# EAGLE schematic LED-Controller (EAGLE 5.11)

## Sheet 1 of 3
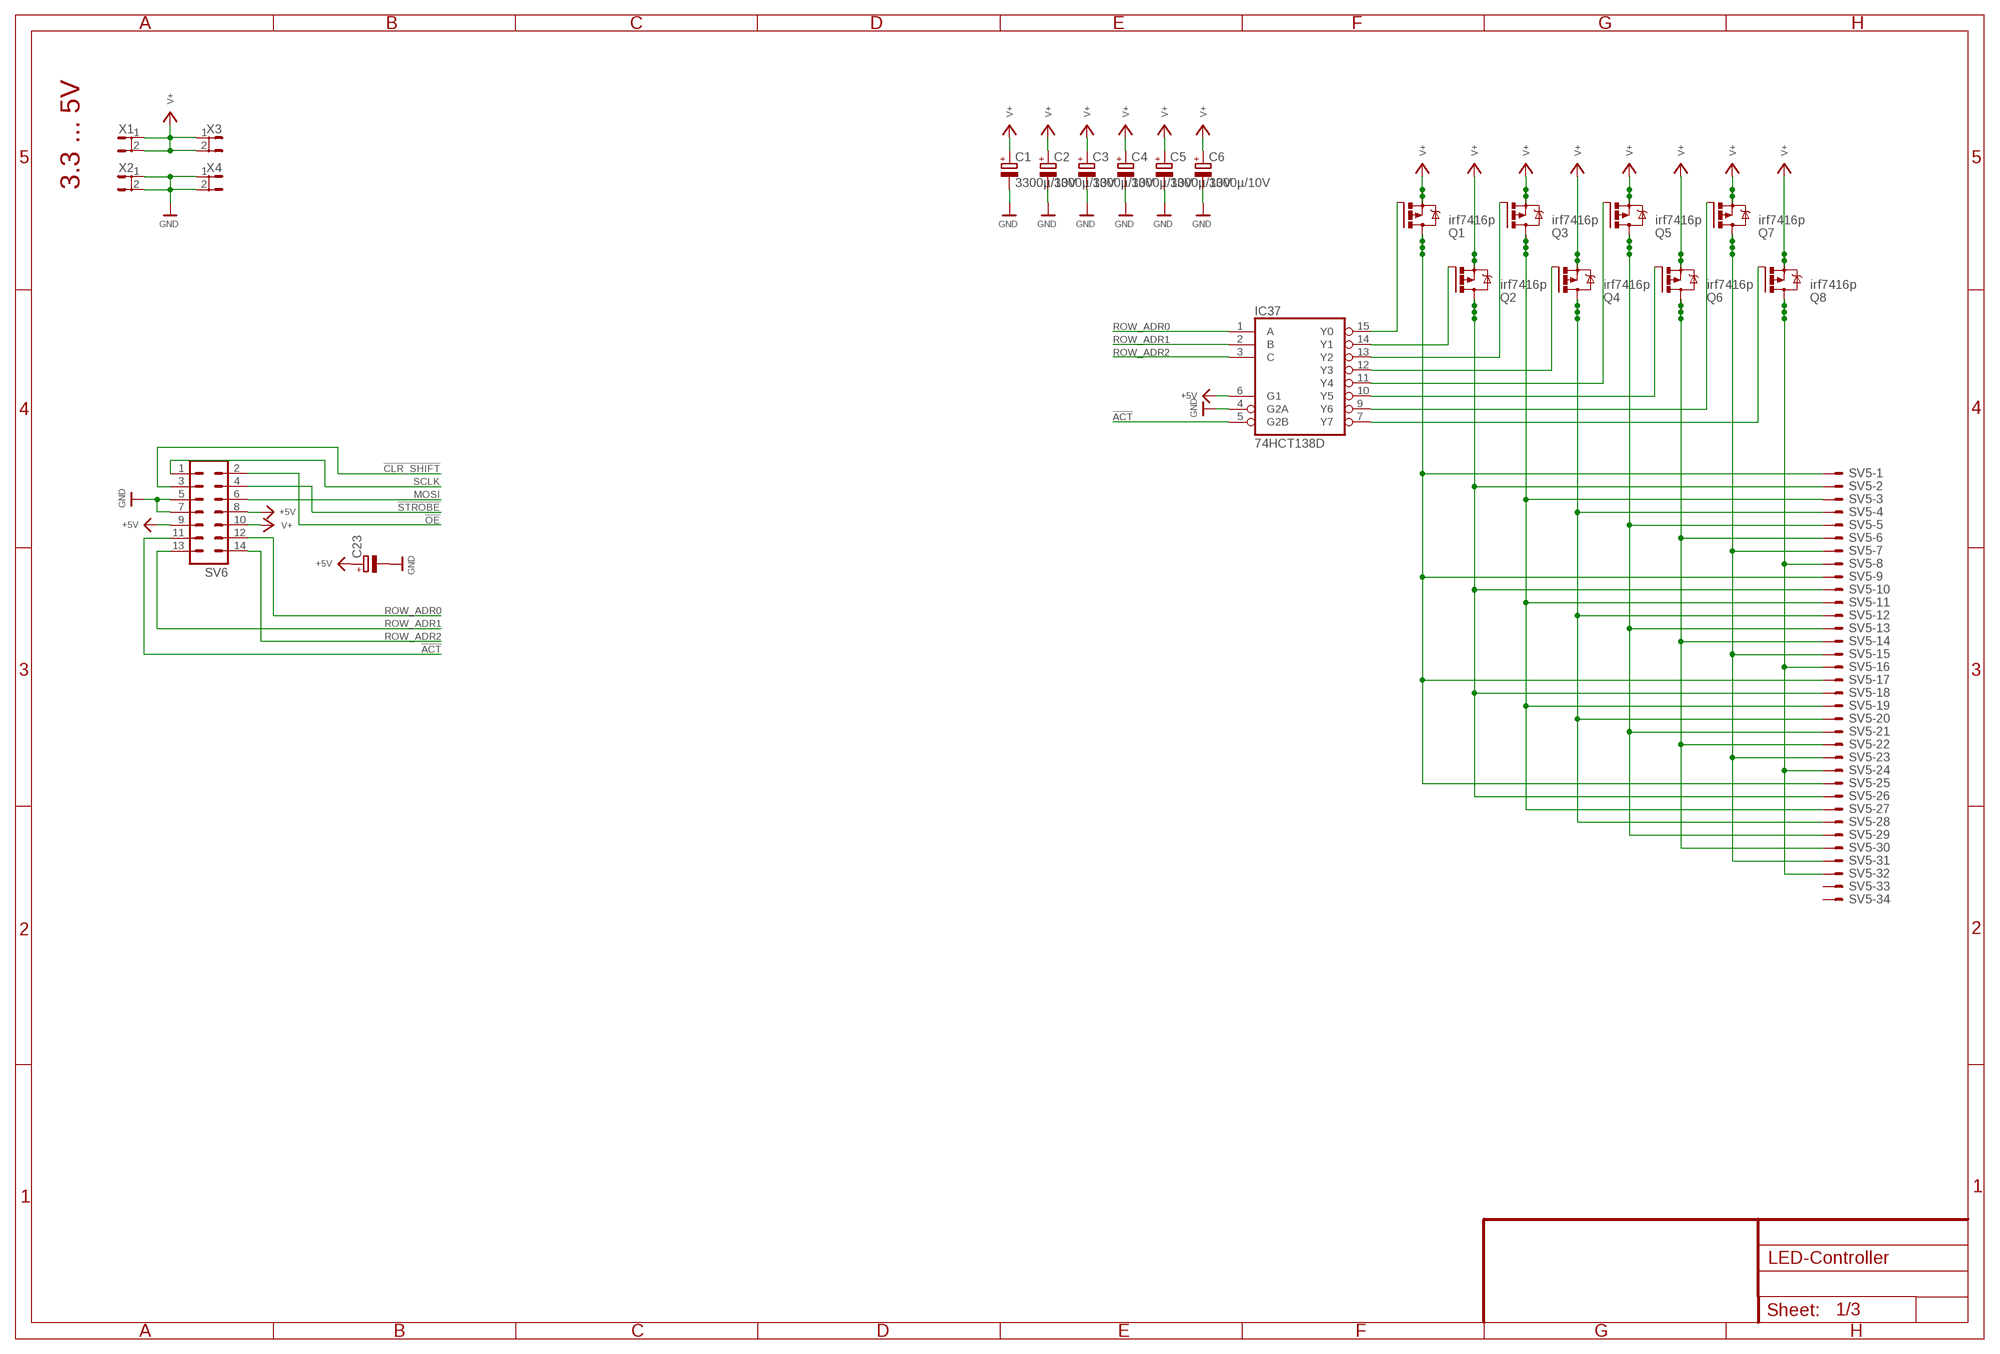
[diagram p0: schematic, sheet 1]

### Parts
C1  3300µ/10V  CPOL-EUE7.5-18  [E7,5-18]
C2  3300µ/10V  CPOL-EUE7.5-18  [E7,5-18]
C3  3300µ/10V  CPOL-EUE7.5-18  [E7,5-18]
C4  3300µ/10V  CPOL-EUE7.5-18  [E7,5-18]
C5  3300µ/10V  CPOL-EUE7.5-18  [E7,5-18]
C6  3300µ/10V  CPOL-EUE7.5-18  [E7,5-18]
C23  CPOL-EUE3.5-8  [E3,5-8]
IC37  74HCT138D  [SO16]
Q1  irf7416p  P-MOSFET-SO8  [SO-08]
Q2  irf7416p  P-MOSFET-SO8  [SO-08]
Q3  irf7416p  P-MOSFET-SO8  [SO-08]
Q4  irf7416p  P-MOSFET-SO8  [SO-08]
Q5  irf7416p  P-MOSFET-SO8  [SO-08]
Q6  irf7416p  P-MOSFET-SO8  [SO-08]
Q7  irf7416p  P-MOSFET-SO8  [SO-08]
Q8  irf7416p  P-MOSFET-SO8  [SO-08]
SV5  ML34E  [ML34]
SV6  ML14  [ML14]
X1  ST6,3  [ST6,3]
X2  ST6,3  [ST6,3]
X3  ST6,3  [ST6,3]
X4  ST6,3  [ST6,3]

### Nets
!ACT: IC37.5(G2B) SV6.11
!CLR_SHIFT: SV6.3 ; also sheet 2
!OE: SV6.2 ; also sheet 2
!STROBE: SV6.4 ; also sheet 2
+5V: C23.+ IC37.6(G1) SV6.8 SV6.9 ; also sheet 2
GND: C1.- C2.- C3.- C4.- C5.- C6.- C23.- IC37.4(G2A) SV6.5 SV6.7 X2.1 X2.2 X4.1 X4.2 ; also sheet 2,3
MOSI: SV6.6 ; also sheet 2
N$144: IC37.15(Y0) Q1.4(G)
N$145: Q1.5(D) Q1.6(D) Q1.7(D) Q1.8(D) SV5.1 SV5.9 SV5.17 SV5.25
N$146: IC37.14(Y1) Q2.4(G)
N$147: IC37.13(Y2) Q3.4(G)
N$148: IC37.12(Y3) Q4.4(G)
N$149: IC37.11(Y4) Q5.4(G)
N$150: IC37.10(Y5) Q6.4(G)
N$151: IC37.9(Y6) Q7.4(G)
N$152: IC37.7(Y7) Q8.4(G)
N$153: Q2.5(D) Q2.6(D) Q2.7(D) Q2.8(D) SV5.2 SV5.10 SV5.18 SV5.26
N$154: Q3.5(D) Q3.6(D) Q3.7(D) Q3.8(D) SV5.3 SV5.11 SV5.19 SV5.27
N$155: Q4.5(D) Q4.6(D) Q4.7(D) Q4.8(D) SV5.4 SV5.12 SV5.20 SV5.28
N$156: Q5.5(D) Q5.6(D) Q5.7(D) Q5.8(D) SV5.5 SV5.13 SV5.21 SV5.29
N$157: Q6.5(D) Q6.6(D) Q6.7(D) Q6.8(D) SV5.6 SV5.14 SV5.22 SV5.30
N$158: Q7.5(D) Q7.6(D) Q7.7(D) Q7.8(D) SV5.7 SV5.15 SV5.23 SV5.31
N$159: Q8.5(D) Q8.6(D) Q8.7(D) Q8.8(D) SV5.8 SV5.16 SV5.24 SV5.32
ROW_ADR0: IC37.1(A) SV6.12
ROW_ADR1: IC37.2(B) SV6.13
ROW_ADR2: IC37.3(C) SV6.14
SCLK: SV6.1 ; also sheet 2
V+: C1.+ C2.+ C3.+ C4.+ C5.+ C6.+ Q1.1(S) Q1.2(S) Q1.3(S) Q2.1(S) Q2.2(S) Q2.3(S) Q3.1(S) Q3.2(S) Q3.3(S) Q4.1(S) Q4.2(S) Q4.3(S) Q5.1(S) Q5.2(S) Q5.3(S) Q6.1(S) Q6.2(S) Q6.3(S) Q7.1(S) Q7.2(S) Q7.3(S) Q8.1(S) Q8.2(S) Q8.3(S) SV6.10 X1.1 X1.2 X3.1 X3.2
Unconnected: SV5.33 SV5.34

### Notes on the sheet
- 3.3 ... 5V

## Sheet 2 of 3
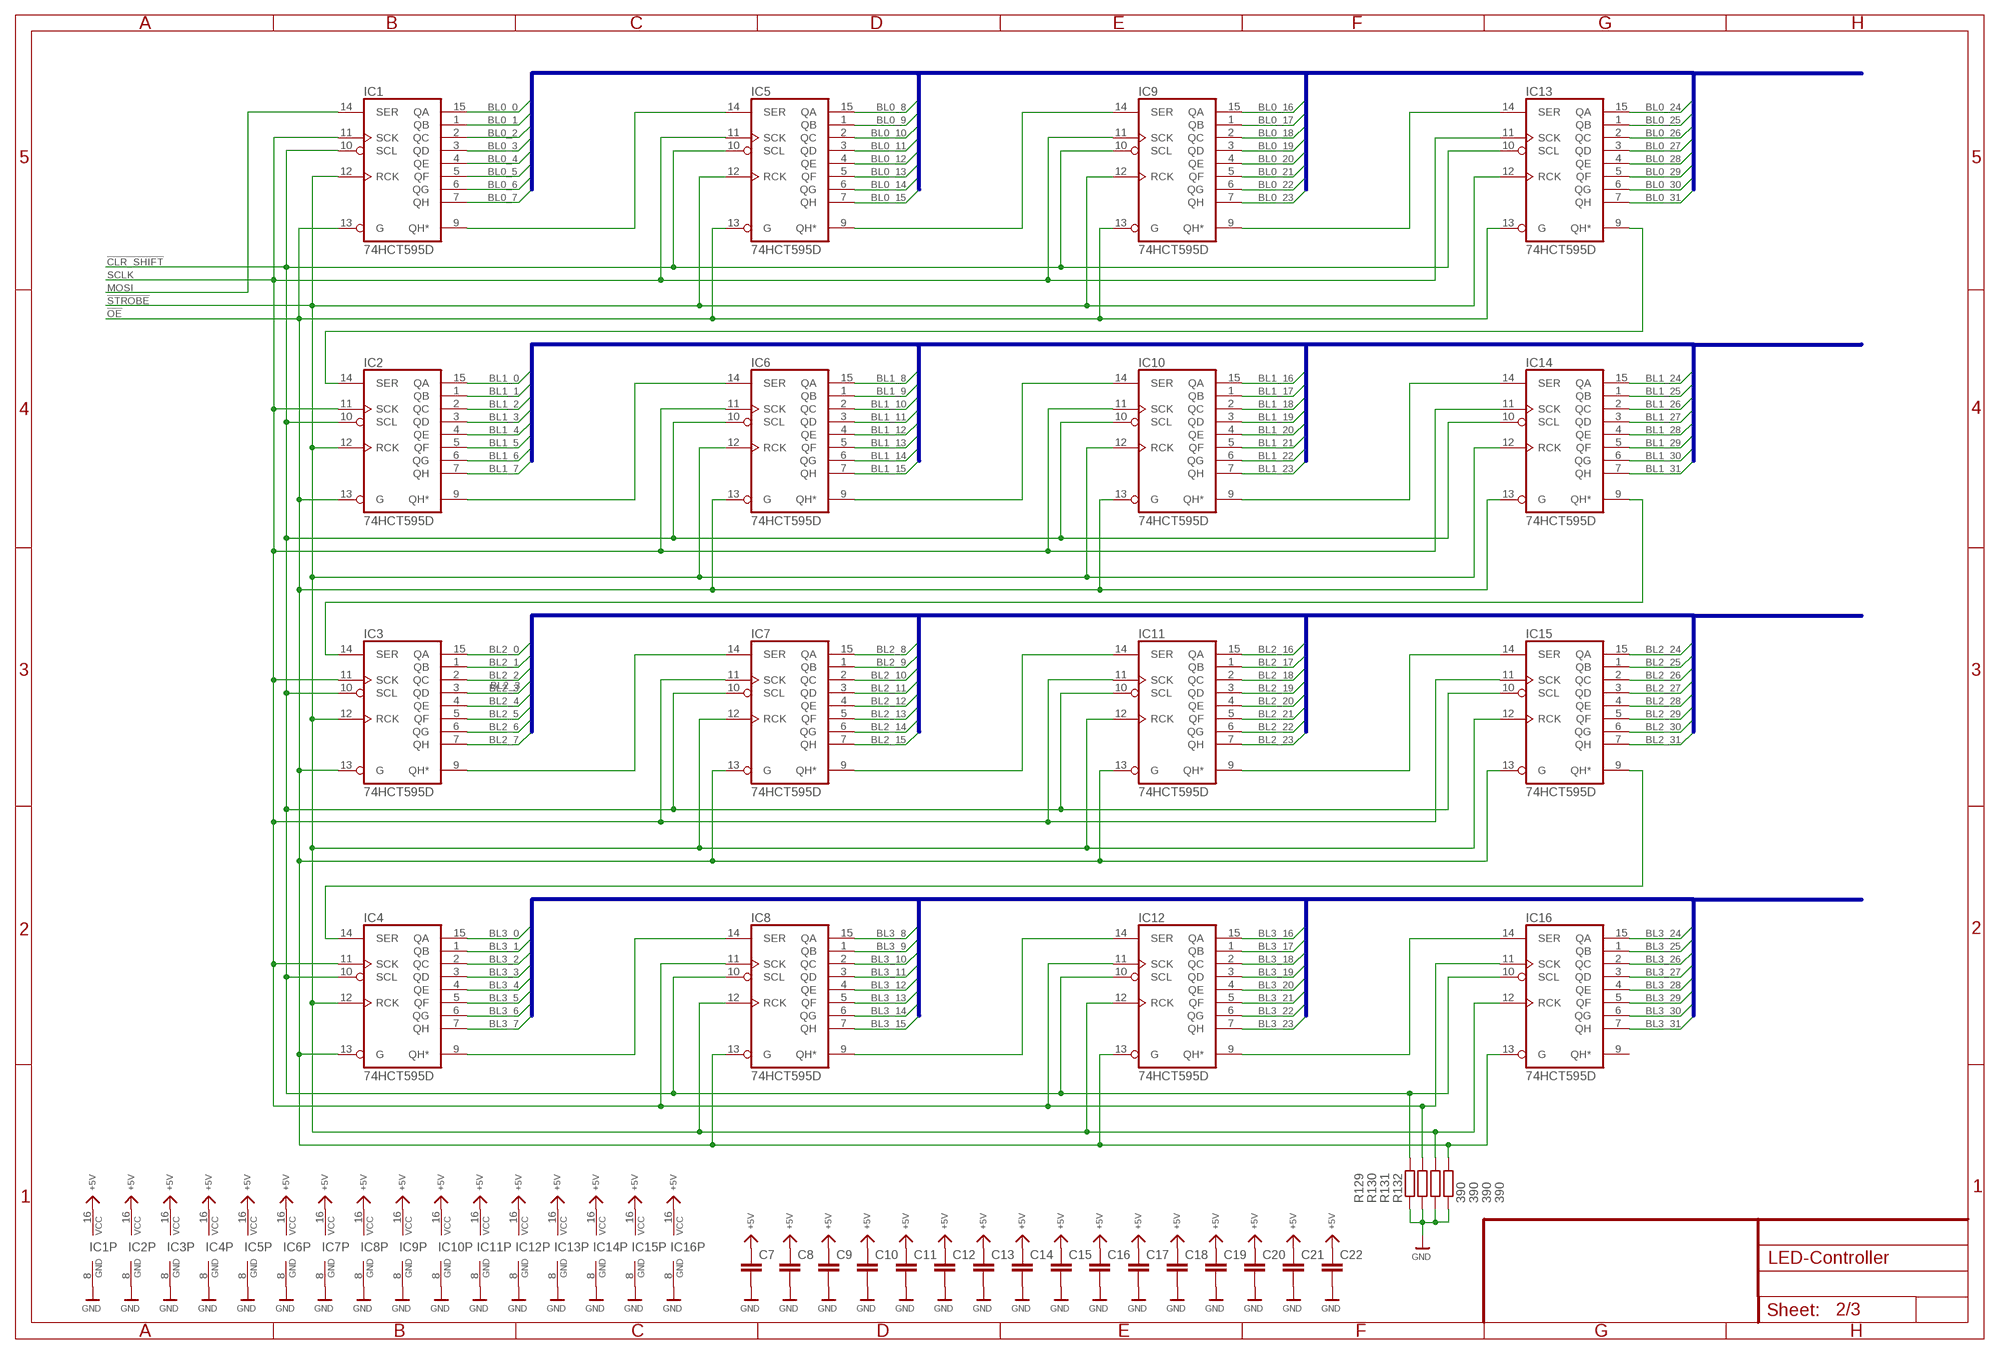
[diagram p1: schematic, sheet 2]

### Parts
C7  C-EUC0805  [C0805]
C8  C-EUC0805  [C0805]
C9  C-EUC0805  [C0805]
C10  C-EUC0805  [C0805]
C11  C-EUC0805  [C0805]
C12  C-EUC0805  [C0805]
C13  C-EUC0805  [C0805]
C14  C-EUC0805  [C0805]
C15  C-EUC0805  [C0805]
C16  C-EUC0805  [C0805]
C17  C-EUC0805  [C0805]
C18  C-EUC0805  [C0805]
C19  C-EUC0805  [C0805]
C20  C-EUC0805  [C0805]
C21  C-EUC0805  [C0805]
C22  C-EUC0805  [C0805]
IC1  74HCT595D  [SO16]
IC2  74HCT595D  [SO16]
IC3  74HCT595D  [SO16]
IC4  74HCT595D  [SO16]
IC5  74HCT595D  [SO16]
IC6  74HCT595D  [SO16]
IC7  74HCT595D  [SO16]
IC8  74HCT595D  [SO16]
IC9  74HCT595D  [SO16]
IC10  74HCT595D  [SO16]
IC11  74HCT595D  [SO16]
IC12  74HCT595D  [SO16]
IC13  74HCT595D  [SO16]
IC14  74HCT595D  [SO16]
IC15  74HCT595D  [SO16]
IC16  74HCT595D  [SO16]
R129  390  R-EU_R0805  [R0805]
R130  390  R-EU_R0805  [R0805]
R131  390  R-EU_R0805  [R0805]
R132  390  R-EU_R0805  [R0805]

### Nets
!CLR_SHIFT: IC1.10(SCL) IC2.10(SCL) IC3.10(SCL) IC4.10(SCL) IC5.10(SCL) IC6.10(SCL) IC7.10(SCL) IC8.10(SCL) IC9.10(SCL) IC10.10(SCL) IC11.10(SCL) IC12.10(SCL) IC13.10(SCL) IC14.10(SCL) IC15.10(SCL) IC16.10(SCL) R129.2 ; also sheet 1
!OE: IC1.13(G) IC2.13(G) IC3.13(G) IC4.13(G) IC5.13(G) IC6.13(G) IC7.13(G) IC8.13(G) IC9.13(G) IC10.13(G) IC11.13(G) IC12.13(G) IC13.13(G) IC14.13(G) IC15.13(G) IC16.13(G) R132.2 ; also sheet 1
!STROBE: IC1.12(RCK) IC2.12(RCK) IC3.12(RCK) IC4.12(RCK) IC5.12(RCK) IC6.12(RCK) IC7.12(RCK) IC8.12(RCK) IC9.12(RCK) IC10.12(RCK) IC11.12(RCK) IC12.12(RCK) IC13.12(RCK) IC14.12(RCK) IC15.12(RCK) IC16.12(RCK) R131.2 ; also sheet 1
+5V: C7.1 C8.1 C9.1 C10.1 C11.1 C12.1 C13.1 C14.1 C15.1 C16.1 C17.1 C18.1 C19.1 C20.1 C21.1 C22.1 IC1.16(VCC) IC2.16(VCC) IC3.16(VCC) IC4.16(VCC) IC5.16(VCC) IC6.16(VCC) IC7.16(VCC) IC8.16(VCC) IC9.16(VCC) IC10.16(VCC) IC11.16(VCC) IC12.16(VCC) IC13.16(VCC) IC14.16(VCC) IC15.16(VCC) IC16.16(VCC) ; also sheet 1
BL0_0: IC1.15(QA) ; also sheet 3
BL0_1: IC1.1(QB) ; also sheet 3
BL0_2: IC1.2(QC) ; also sheet 3
BL0_3: IC1.3(QD) ; also sheet 3
BL0_4: IC1.4(QE) ; also sheet 3
BL0_5: IC1.5(QF) ; also sheet 3
BL0_6: IC1.6(QG) ; also sheet 3
BL0_7: IC1.7(QH) ; also sheet 3
BL0_8: IC5.15(QA) ; also sheet 3
BL0_9: IC5.1(QB) ; also sheet 3
BL0_10: IC5.2(QC) ; also sheet 3
BL0_11: IC5.3(QD) ; also sheet 3
BL0_12: IC5.4(QE) ; also sheet 3
BL0_13: IC5.5(QF) ; also sheet 3
BL0_14: IC5.6(QG) ; also sheet 3
BL0_15: IC5.7(QH) ; also sheet 3
BL0_16: IC9.15(QA) ; also sheet 3
BL0_17: IC9.1(QB) ; also sheet 3
BL0_18: IC9.2(QC) ; also sheet 3
BL0_19: IC9.3(QD) ; also sheet 3
BL0_20: IC9.4(QE) ; also sheet 3
BL0_21: IC9.5(QF) ; also sheet 3
BL0_22: IC9.6(QG) ; also sheet 3
BL0_23: IC9.7(QH) ; also sheet 3
BL0_24: IC13.15(QA) ; also sheet 3
BL0_25: IC13.1(QB) ; also sheet 3
BL0_26: IC13.2(QC) ; also sheet 3
BL0_27: IC13.3(QD) ; also sheet 3
BL0_28: IC13.4(QE) ; also sheet 3
BL0_29: IC13.5(QF) ; also sheet 3
BL0_30: IC13.6(QG) ; also sheet 3
BL0_31: IC13.7(QH) ; also sheet 3
BL1_0: IC2.15(QA) ; also sheet 3
BL1_1: IC2.1(QB) ; also sheet 3
BL1_2: IC2.2(QC) ; also sheet 3
BL1_3: IC2.3(QD) ; also sheet 3
BL1_4: IC2.4(QE) ; also sheet 3
BL1_5: IC2.5(QF) ; also sheet 3
BL1_6: IC2.6(QG) ; also sheet 3
BL1_7: IC2.7(QH) ; also sheet 3
BL1_8: IC6.15(QA) ; also sheet 3
BL1_9: IC6.1(QB) ; also sheet 3
BL1_10: IC6.2(QC) ; also sheet 3
BL1_11: IC6.3(QD) ; also sheet 3
BL1_12: IC6.4(QE) ; also sheet 3
BL1_13: IC6.5(QF) ; also sheet 3
BL1_14: IC6.6(QG) ; also sheet 3
BL1_15: IC6.7(QH) ; also sheet 3
BL1_16: IC10.15(QA) ; also sheet 3
BL1_17: IC10.1(QB) ; also sheet 3
BL1_18: IC10.2(QC) ; also sheet 3
BL1_19: IC10.3(QD) ; also sheet 3
BL1_20: IC10.4(QE) ; also sheet 3
BL1_21: IC10.5(QF) ; also sheet 3
BL1_22: IC10.6(QG) ; also sheet 3
BL1_23: IC10.7(QH) ; also sheet 3
BL1_24: IC14.15(QA) ; also sheet 3
BL1_25: IC14.1(QB) ; also sheet 3
BL1_26: IC14.2(QC) ; also sheet 3
BL1_27: IC14.3(QD) ; also sheet 3
BL1_28: IC14.4(QE) ; also sheet 3
BL1_29: IC14.5(QF) ; also sheet 3
BL1_30: IC14.6(QG) ; also sheet 3
BL1_31: IC14.7(QH) ; also sheet 3
BL2_0: IC3.15(QA) ; also sheet 3
BL2_1: IC3.1(QB) ; also sheet 3
BL2_2: IC3.2(QC) ; also sheet 3
BL2_3: IC3.3(QD) ; also sheet 3
BL2_4: IC3.4(QE) ; also sheet 3
BL2_5: IC3.5(QF) ; also sheet 3
BL2_6: IC3.6(QG) ; also sheet 3
BL2_7: IC3.7(QH) ; also sheet 3
BL2_8: IC7.15(QA) ; also sheet 3
BL2_9: IC7.1(QB) ; also sheet 3
BL2_10: IC7.2(QC) ; also sheet 3
BL2_11: IC7.3(QD) ; also sheet 3
BL2_12: IC7.4(QE) ; also sheet 3
BL2_13: IC7.5(QF) ; also sheet 3
BL2_14: IC7.6(QG) ; also sheet 3
BL2_15: IC7.7(QH) ; also sheet 3
BL2_16: IC11.15(QA) ; also sheet 3
BL2_17: IC11.1(QB) ; also sheet 3
BL2_18: IC11.2(QC) ; also sheet 3
BL2_19: IC11.3(QD) ; also sheet 3
BL2_20: IC11.4(QE) ; also sheet 3
BL2_21: IC11.5(QF) ; also sheet 3
BL2_22: IC11.6(QG) ; also sheet 3
BL2_23: IC11.7(QH) ; also sheet 3
BL2_24: IC15.15(QA) ; also sheet 3
BL2_25: IC15.1(QB) ; also sheet 3
BL2_26: IC15.2(QC) ; also sheet 3
BL2_27: IC15.3(QD) ; also sheet 3
BL2_28: IC15.4(QE) ; also sheet 3
BL2_29: IC15.5(QF) ; also sheet 3
BL2_30: IC15.6(QG) ; also sheet 3
BL2_31: IC15.7(QH) ; also sheet 3
BL3_0: IC4.15(QA) ; also sheet 3
BL3_1: IC4.1(QB) ; also sheet 3
BL3_2: IC4.2(QC) ; also sheet 3
BL3_3: IC4.3(QD) ; also sheet 3
BL3_4: IC4.4(QE) ; also sheet 3
BL3_5: IC4.5(QF) ; also sheet 3
BL3_6: IC4.6(QG) ; also sheet 3
BL3_7: IC4.7(QH) ; also sheet 3
BL3_8: IC8.15(QA) ; also sheet 3
BL3_9: IC8.1(QB) ; also sheet 3
BL3_10: IC8.2(QC) ; also sheet 3
BL3_11: IC8.3(QD) ; also sheet 3
BL3_12: IC8.4(QE) ; also sheet 3
BL3_13: IC8.5(QF) ; also sheet 3
BL3_14: IC8.6(QG) ; also sheet 3
BL3_15: IC8.7(QH) ; also sheet 3
BL3_16: IC12.15(QA) ; also sheet 3
BL3_17: IC12.1(QB) ; also sheet 3
BL3_18: IC12.2(QC) ; also sheet 3
BL3_19: IC12.3(QD) ; also sheet 3
BL3_20: IC12.4(QE) ; also sheet 3
BL3_21: IC12.5(QF) ; also sheet 3
BL3_22: IC12.6(QG) ; also sheet 3
BL3_23: IC12.7(QH) ; also sheet 3
BL3_24: IC16.15(QA) ; also sheet 3
BL3_25: IC16.1(QB) ; also sheet 3
BL3_26: IC16.2(QC) ; also sheet 3
BL3_27: IC16.3(QD) ; also sheet 3
BL3_28: IC16.4(QE) ; also sheet 3
BL3_29: IC16.5(QF) ; also sheet 3
BL3_30: IC16.6(QG) ; also sheet 3
BL3_31: IC16.7(QH) ; also sheet 3
GND: C7.2 C8.2 C9.2 C10.2 C11.2 C12.2 C13.2 C14.2 C15.2 C16.2 C17.2 C18.2 C19.2 C20.2 C21.2 C22.2 IC1.8(GND) IC2.8(GND) IC3.8(GND) IC4.8(GND) IC5.8(GND) IC6.8(GND) IC7.8(GND) IC8.8(GND) IC9.8(GND) IC10.8(GND) IC11.8(GND) IC12.8(GND) IC13.8(GND) IC14.8(GND) IC15.8(GND) IC16.8(GND) R129.1 R130.1 R131.1 R132.1 ; also sheet 1,3
MOSI: IC1.14(SER) ; also sheet 1
N$2: IC1.9(QH*) IC5.14(SER)
N$3: IC5.9(QH*) IC9.14(SER)
N$4: IC9.9(QH*) IC13.14(SER)
N$5: IC2.14(SER) IC13.9(QH*)
N$6: IC2.9(QH*) IC6.14(SER)
N$7: IC6.9(QH*) IC10.14(SER)
N$8: IC10.9(QH*) IC14.14(SER)
N$9: IC3.14(SER) IC14.9(QH*)
N$10: IC3.9(QH*) IC7.14(SER)
N$11: IC7.9(QH*) IC11.14(SER)
N$12: IC11.9(QH*) IC15.14(SER)
N$13: IC4.14(SER) IC15.9(QH*)
N$14: IC4.9(QH*) IC8.14(SER)
N$15: IC8.9(QH*) IC12.14(SER)
N$16: IC12.9(QH*) IC16.14(SER)
SCLK: IC1.11(SCK) IC2.11(SCK) IC3.11(SCK) IC4.11(SCK) IC5.11(SCK) IC6.11(SCK) IC7.11(SCK) IC8.11(SCK) IC9.11(SCK) IC10.11(SCK) IC11.11(SCK) IC12.11(SCK) IC13.11(SCK) IC14.11(SCK) IC15.11(SCK) IC16.11(SCK) R130.2 ; also sheet 1
Unconnected: IC16.9(QH*)

### Buses
BL3_[0..31]
BL0_[0..31]
BL1_[0..31]
BL2_[0..31]

## Sheet 3 of 3
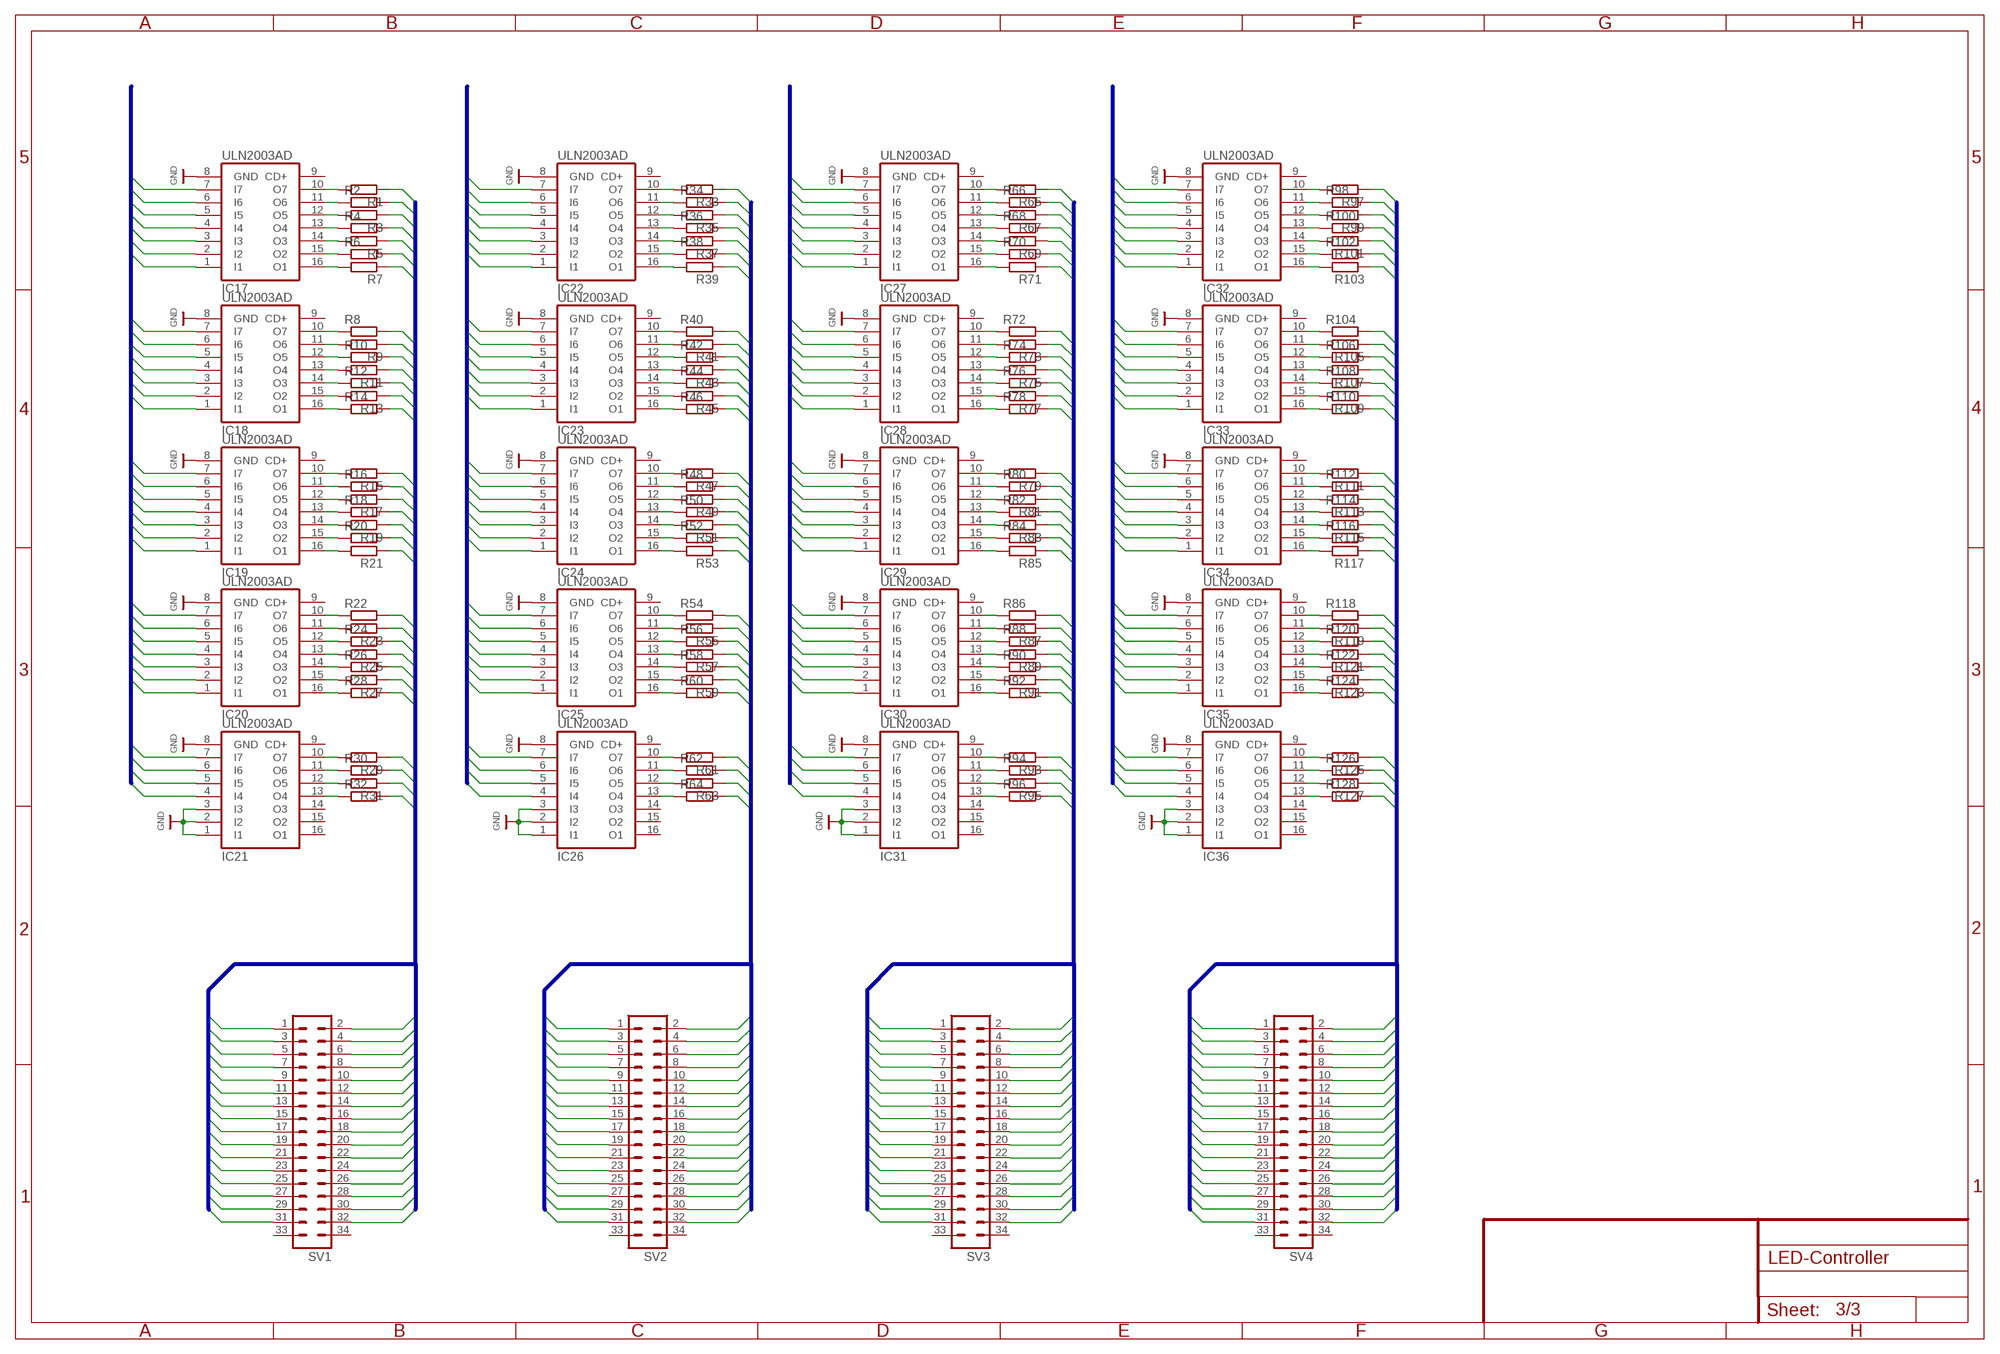
[diagram p2: schematic, sheet 3]

### Parts
IC17  ULN2003AD  [SO16]
IC18  ULN2003AD  [SO16]
IC19  ULN2003AD  [SO16]
IC20  ULN2003AD  [SO16]
IC21  ULN2003AD  [SO16]
IC22  ULN2003AD  [SO16]
IC23  ULN2003AD  [SO16]
IC24  ULN2003AD  [SO16]
IC25  ULN2003AD  [SO16]
IC26  ULN2003AD  [SO16]
IC27  ULN2003AD  [SO16]
IC28  ULN2003AD  [SO16]
IC29  ULN2003AD  [SO16]
IC30  ULN2003AD  [SO16]
IC31  ULN2003AD  [SO16]
IC32  ULN2003AD  [SO16]
IC33  ULN2003AD  [SO16]
IC34  ULN2003AD  [SO16]
IC35  ULN2003AD  [SO16]
IC36  ULN2003AD  [SO16]
R1  R-EU_0207/5V  [0207/5V]
R2  R-EU_0207/5V  [0207/5V]
R3  R-EU_0207/5V  [0207/5V]
R4  R-EU_0207/5V  [0207/5V]
R5  R-EU_0207/5V  [0207/5V]
R6  R-EU_0207/5V  [0207/5V]
R7  R-EU_0207/5V  [0207/5V]
R8  R-EU_0207/5V  [0207/5V]
R9  R-EU_0207/5V  [0207/5V]
R10  R-EU_0207/5V  [0207/5V]
R11  R-EU_0207/5V  [0207/5V]
R12  R-EU_0207/5V  [0207/5V]
R13  R-EU_0207/5V  [0207/5V]
R14  R-EU_0207/5V  [0207/5V]
R15  R-EU_0207/5V  [0207/5V]
R16  R-EU_0207/5V  [0207/5V]
R17  R-EU_0207/5V  [0207/5V]
R18  R-EU_0207/5V  [0207/5V]
R19  R-EU_0207/5V  [0207/5V]
R20  R-EU_0207/5V  [0207/5V]
R21  R-EU_0207/5V  [0207/5V]
R22  R-EU_0207/5V  [0207/5V]
R23  R-EU_0207/5V  [0207/5V]
R24  R-EU_0207/5V  [0207/5V]
R25  R-EU_0207/5V  [0207/5V]
R26  R-EU_0207/5V  [0207/5V]
R27  R-EU_0207/5V  [0207/5V]
R28  R-EU_0207/5V  [0207/5V]
R29  R-EU_0207/5V  [0207/5V]
R30  R-EU_0207/5V  [0207/5V]
R31  R-EU_0207/5V  [0207/5V]
R32  R-EU_0207/5V  [0207/5V]
R33  R-EU_0207/5V  [0207/5V]
R34  R-EU_0207/5V  [0207/5V]
R35  R-EU_0207/5V  [0207/5V]
R36  R-EU_0207/5V  [0207/5V]
R37  R-EU_0207/5V  [0207/5V]
R38  R-EU_0207/5V  [0207/5V]
R39  R-EU_0207/5V  [0207/5V]
R40  R-EU_0207/5V  [0207/5V]
R41  R-EU_0207/5V  [0207/5V]
R42  R-EU_0207/5V  [0207/5V]
R43  R-EU_0207/5V  [0207/5V]
R44  R-EU_0207/5V  [0207/5V]
R45  R-EU_0207/5V  [0207/5V]
R46  R-EU_0207/5V  [0207/5V]
R47  R-EU_0207/5V  [0207/5V]
R48  R-EU_0207/5V  [0207/5V]
R49  R-EU_0207/5V  [0207/5V]
R50  R-EU_0207/5V  [0207/5V]
R51  R-EU_0207/5V  [0207/5V]
R52  R-EU_0207/5V  [0207/5V]
R53  R-EU_0207/5V  [0207/5V]
R54  R-EU_0207/5V  [0207/5V]
R55  R-EU_0207/5V  [0207/5V]
R56  R-EU_0207/5V  [0207/5V]
R57  R-EU_0207/5V  [0207/5V]
R58  R-EU_0207/5V  [0207/5V]
R59  R-EU_0207/5V  [0207/5V]
R60  R-EU_0207/5V  [0207/5V]
R61  R-EU_0207/5V  [0207/5V]
R62  R-EU_0207/5V  [0207/5V]
R63  R-EU_0207/5V  [0207/5V]
R64  R-EU_0207/5V  [0207/5V]
R65  R-EU_0207/5V  [0207/5V]
R66  R-EU_0207/5V  [0207/5V]
R67  R-EU_0207/5V  [0207/5V]
R68  R-EU_0207/5V  [0207/5V]
R69  R-EU_0207/5V  [0207/5V]
R70  R-EU_0207/5V  [0207/5V]
R71  R-EU_0207/5V  [0207/5V]
R72  R-EU_0207/5V  [0207/5V]
R73  R-EU_0207/5V  [0207/5V]
R74  R-EU_0207/5V  [0207/5V]
R75  R-EU_0207/5V  [0207/5V]
R76  R-EU_0207/5V  [0207/5V]
R77  R-EU_0207/5V  [0207/5V]
R78  R-EU_0207/5V  [0207/5V]
R79  R-EU_0207/5V  [0207/5V]
R80  R-EU_0207/5V  [0207/5V]
R81  R-EU_0207/5V  [0207/5V]
R82  R-EU_0207/5V  [0207/5V]
R83  R-EU_0207/5V  [0207/5V]
R84  R-EU_0207/5V  [0207/5V]
R85  R-EU_0207/5V  [0207/5V]
R86  R-EU_0207/5V  [0207/5V]
R87  R-EU_0207/5V  [0207/5V]
R88  R-EU_0207/5V  [0207/5V]
R89  R-EU_0207/5V  [0207/5V]
R90  R-EU_0207/5V  [0207/5V]
R91  R-EU_0207/5V  [0207/5V]
R92  R-EU_0207/5V  [0207/5V]
R93  R-EU_0207/5V  [0207/5V]
R94  R-EU_0207/5V  [0207/5V]
R95  R-EU_0207/5V  [0207/5V]
R96  R-EU_0207/5V  [0207/5V]
R97  R-EU_0207/5V  [0207/5V]
R98  R-EU_0207/5V  [0207/5V]
R99  R-EU_0207/5V  [0207/5V]
R100  R-EU_0207/5V  [0207/5V]
R101  R-EU_0207/5V  [0207/5V]
R102  R-EU_0207/5V  [0207/5V]
R103  R-EU_0207/5V  [0207/5V]
R104  R-EU_0207/5V  [0207/5V]
R105  R-EU_0207/5V  [0207/5V]
R106  R-EU_0207/5V  [0207/5V]
R107  R-EU_0207/5V  [0207/5V]
R108  R-EU_0207/5V  [0207/5V]
R109  R-EU_0207/5V  [0207/5V]
R110  R-EU_0207/5V  [0207/5V]
R111  R-EU_0207/5V  [0207/5V]
R112  R-EU_0207/5V  [0207/5V]
R113  R-EU_0207/5V  [0207/5V]
R114  R-EU_0207/5V  [0207/5V]
R115  R-EU_0207/5V  [0207/5V]
R116  R-EU_0207/5V  [0207/5V]
R117  R-EU_0207/5V  [0207/5V]
R118  R-EU_0207/5V  [0207/5V]
R119  R-EU_0207/5V  [0207/5V]
R120  R-EU_0207/5V  [0207/5V]
R121  R-EU_0207/5V  [0207/5V]
R122  R-EU_0207/5V  [0207/5V]
R123  R-EU_0207/5V  [0207/5V]
R124  R-EU_0207/5V  [0207/5V]
R125  R-EU_0207/5V  [0207/5V]
R126  R-EU_0207/5V  [0207/5V]
R127  R-EU_0207/5V  [0207/5V]
R128  R-EU_0207/5V  [0207/5V]
SV1  ML34  [ML34]
SV2  ML34  [ML34]
SV3  ML34  [ML34]
SV4  ML34  [ML34]

### Nets
BL0_0: IC17.7(I7) ; also sheet 2
BL0_1: IC17.6(I6) ; also sheet 2
BL0_2: IC17.5(I5) ; also sheet 2
BL0_3: IC17.4(I4) ; also sheet 2
BL0_4: IC17.3(I3) ; also sheet 2
BL0_5: IC17.2(I2) ; also sheet 2
BL0_6: IC17.1(I1) ; also sheet 2
BL0_7: IC18.7(I7) ; also sheet 2
BL0_8: IC18.6(I6) ; also sheet 2
BL0_9: IC18.5(I5) ; also sheet 2
BL0_10: IC18.4(I4) ; also sheet 2
BL0_11: IC18.3(I3) ; also sheet 2
BL0_12: IC18.2(I2) ; also sheet 2
BL0_13: IC18.1(I1) ; also sheet 2
BL0_14: IC19.7(I7) ; also sheet 2
BL0_15: IC19.6(I6) ; also sheet 2
BL0_16: IC19.5(I5) ; also sheet 2
BL0_17: IC19.4(I4) ; also sheet 2
BL0_18: IC19.3(I3) ; also sheet 2
BL0_19: IC19.2(I2) ; also sheet 2
BL0_20: IC19.1(I1) ; also sheet 2
BL0_21: IC20.7(I7) ; also sheet 2
BL0_22: IC20.6(I6) ; also sheet 2
BL0_23: IC20.5(I5) ; also sheet 2
BL0_24: IC20.4(I4) ; also sheet 2
BL0_25: IC20.3(I3) ; also sheet 2
BL0_26: IC20.2(I2) ; also sheet 2
BL0_27: IC20.1(I1) ; also sheet 2
BL0_28: IC21.7(I7) ; also sheet 2
BL0_29: IC21.6(I6) ; also sheet 2
BL0_30: IC21.5(I5) ; also sheet 2
BL0_31: IC21.4(I4) ; also sheet 2
BL1_0: IC22.7(I7) ; also sheet 2
BL1_1: IC22.6(I6) ; also sheet 2
BL1_2: IC22.5(I5) ; also sheet 2
BL1_3: IC22.4(I4) ; also sheet 2
BL1_4: IC22.3(I3) ; also sheet 2
BL1_5: IC22.2(I2) ; also sheet 2
BL1_6: IC22.1(I1) ; also sheet 2
BL1_7: IC23.7(I7) ; also sheet 2
BL1_8: IC23.6(I6) ; also sheet 2
BL1_9: IC23.5(I5) ; also sheet 2
BL1_10: IC23.4(I4) ; also sheet 2
BL1_11: IC23.3(I3) ; also sheet 2
BL1_12: IC23.2(I2) ; also sheet 2
BL1_13: IC23.1(I1) ; also sheet 2
BL1_14: IC24.7(I7) ; also sheet 2
BL1_15: IC24.6(I6) ; also sheet 2
BL1_16: IC24.5(I5) ; also sheet 2
BL1_17: IC24.4(I4) ; also sheet 2
BL1_18: IC24.3(I3) ; also sheet 2
BL1_19: IC24.2(I2) ; also sheet 2
BL1_20: IC24.1(I1) ; also sheet 2
BL1_21: IC25.7(I7) ; also sheet 2
BL1_22: IC25.6(I6) ; also sheet 2
BL1_23: IC25.5(I5) ; also sheet 2
BL1_24: IC25.4(I4) ; also sheet 2
BL1_25: IC25.3(I3) ; also sheet 2
BL1_26: IC25.2(I2) ; also sheet 2
BL1_27: IC25.1(I1) ; also sheet 2
BL1_28: IC26.7(I7) ; also sheet 2
BL1_29: IC26.6(I6) ; also sheet 2
BL1_30: IC26.5(I5) ; also sheet 2
BL1_31: IC26.4(I4) ; also sheet 2
BL2_0: IC27.7(I7) ; also sheet 2
BL2_1: IC27.6(I6) ; also sheet 2
BL2_2: IC27.5(I5) ; also sheet 2
BL2_3: IC27.4(I4) ; also sheet 2
BL2_4: IC27.3(I3) ; also sheet 2
BL2_5: IC27.2(I2) ; also sheet 2
BL2_6: IC27.1(I1) ; also sheet 2
BL2_7: IC28.7(I7) ; also sheet 2
BL2_8: IC28.6(I6) ; also sheet 2
BL2_9: IC28.5(I5) ; also sheet 2
BL2_10: IC28.4(I4) ; also sheet 2
BL2_11: IC28.3(I3) ; also sheet 2
BL2_12: IC28.2(I2) ; also sheet 2
BL2_13: IC28.1(I1) ; also sheet 2
BL2_14: IC29.7(I7) ; also sheet 2
BL2_15: IC29.6(I6) ; also sheet 2
BL2_16: IC29.5(I5) ; also sheet 2
BL2_17: IC29.4(I4) ; also sheet 2
BL2_18: IC29.3(I3) ; also sheet 2
BL2_19: IC29.2(I2) ; also sheet 2
BL2_20: IC29.1(I1) ; also sheet 2
BL2_21: IC30.7(I7) ; also sheet 2
BL2_22: IC30.6(I6) ; also sheet 2
BL2_23: IC30.5(I5) ; also sheet 2
BL2_24: IC30.4(I4) ; also sheet 2
BL2_25: IC30.3(I3) ; also sheet 2
BL2_26: IC30.2(I2) ; also sheet 2
BL2_27: IC30.1(I1) ; also sheet 2
BL2_28: IC31.7(I7) ; also sheet 2
BL2_29: IC31.6(I6) ; also sheet 2
BL2_30: IC31.5(I5) ; also sheet 2
BL2_31: IC31.4(I4) ; also sheet 2
BL3_0: IC32.7(I7) ; also sheet 2
BL3_1: IC32.6(I6) ; also sheet 2
BL3_2: IC32.5(I5) ; also sheet 2
BL3_3: IC32.4(I4) ; also sheet 2
BL3_4: IC32.3(I3) ; also sheet 2
BL3_5: IC32.2(I2) ; also sheet 2
BL3_6: IC32.1(I1) ; also sheet 2
BL3_7: IC33.7(I7) ; also sheet 2
BL3_8: IC33.6(I6) ; also sheet 2
BL3_9: IC33.5(I5) ; also sheet 2
BL3_10: IC33.4(I4) ; also sheet 2
BL3_11: IC33.3(I3) ; also sheet 2
BL3_12: IC33.2(I2) ; also sheet 2
BL3_13: IC33.1(I1) ; also sheet 2
BL3_14: IC34.7(I7) ; also sheet 2
BL3_15: IC34.6(I6) ; also sheet 2
BL3_16: IC34.5(I5) ; also sheet 2
BL3_17: IC34.4(I4) ; also sheet 2
BL3_18: IC34.3(I3) ; also sheet 2
BL3_19: IC34.2(I2) ; also sheet 2
BL3_20: IC34.1(I1) ; also sheet 2
BL3_21: IC35.7(I7) ; also sheet 2
BL3_22: IC35.6(I6) ; also sheet 2
BL3_23: IC35.5(I5) ; also sheet 2
BL3_24: IC35.4(I4) ; also sheet 2
BL3_25: IC35.3(I3) ; also sheet 2
BL3_26: IC35.2(I2) ; also sheet 2
BL3_27: IC35.1(I1) ; also sheet 2
BL3_28: IC36.7(I7) ; also sheet 2
BL3_29: IC36.6(I6) ; also sheet 2
BL3_30: IC36.5(I5) ; also sheet 2
BL3_31: IC36.4(I4) ; also sheet 2
GND: IC17.8(GND) IC18.8(GND) IC19.8(GND) IC20.8(GND) IC21.1(I1) IC21.2(I2) IC21.3(I3) IC21.8(GND) IC22.8(GND) IC23.8(GND) IC24.8(GND) IC25.8(GND) IC26.1(I1) IC26.2(I2) IC26.3(I3) IC26.8(GND) IC27.8(GND) IC28.8(GND) IC29.8(GND) IC30.8(GND) IC31.1(I1) IC31.2(I2) IC31.3(I3) IC31.8(GND) IC32.8(GND) IC33.8(GND) IC34.8(GND) IC35.8(GND) IC36.1(I1) IC36.2(I2) IC36.3(I3) IC36.8(GND) ; also sheet 1,2
L0_0: R1.1 SV1.1
L0_1: R2.2 SV1.2
L0_2: R3.1 SV1.3
L0_3: R4.2 SV1.4
L0_4: R5.1 SV1.5
L0_5: R6.2 SV1.6
L0_6: R7.1 SV1.7
L0_7: R8.2 SV1.8
L0_8: R9.1 SV1.9
L0_9: R10.2 SV1.10
L0_10: R11.1 SV1.11
L0_11: R12.2 SV1.12
L0_12: R13.1 SV1.13
L0_13: R14.2 SV1.14
L0_14: R15.1 SV1.15
L0_15: R16.2 SV1.16
L0_16: R17.1 SV1.17
L0_17: R18.2 SV1.18
L0_18: R19.1 SV1.19
L0_19: R20.2 SV1.20
L0_20: R21.1 SV1.21
L0_21: R22.2 SV1.22
L0_22: R23.1 SV1.23
L0_23: R24.2 SV1.24
L0_24: R25.1 SV1.25
L0_25: R26.2 SV1.26
L0_26: R27.1 SV1.27
L0_27: R28.2 SV1.28
L0_28: R29.1 SV1.29
L0_29: R30.2 SV1.30
L0_30: R31.1 SV1.31
L0_31: R32.2 SV1.32
L1_0: R33.1 SV2.1
L1_1: R34.2 SV2.2
L1_2: R35.1 SV2.3
L1_3: R36.2 SV2.4
L1_4: R37.1 SV2.5
L1_5: R38.2 SV2.6
L1_6: R39.1 SV2.7
L1_7: R40.2 SV2.8
L1_8: R41.1 SV2.9
L1_9: R42.2 SV2.10
L1_10: R43.1 SV2.11
L1_11: R44.2 SV2.12
L1_12: R45.1 SV2.13
L1_13: R46.2 SV2.14
L1_14: R47.1 SV2.15
L1_15: R48.2 SV2.16
L1_16: R49.1 SV2.17
L1_17: R50.2 SV2.18
L1_18: R51.1 SV2.19
L1_19: R52.2 SV2.20
L1_20: R53.1 SV2.21
L1_21: R54.2 SV2.22
L1_22: R55.1 SV2.23
L1_23: R56.2 SV2.24
L1_24: R57.1 SV2.25
L1_25: R58.2 SV2.26
L1_26: R59.1 SV2.27
L1_27: R60.2 SV2.28
L1_28: R61.1 SV2.29
L1_29: R62.2 SV2.30
L1_30: R63.1 SV2.31
L1_31: R64.2 SV2.32
L2_0: R65.1 SV3.1
L2_1: R66.2 SV3.2
L2_2: R67.1 SV3.3
L2_3: R68.2 SV3.4
L2_4: R69.1 SV3.5
L2_5: R70.2 SV3.6
L2_6: R71.1 SV3.7
L2_7: R72.2 SV3.8
L2_8: R73.1 SV3.9
L2_9: R74.2 SV3.10
L2_10: R75.1 SV3.11
L2_11: R76.2 SV3.12
L2_12: R77.1 SV3.13
L2_13: R78.2 SV3.14
L2_14: R79.1 SV3.15
L2_15: R80.2 SV3.16
L2_16: R81.1 SV3.17
L2_17: R82.2 SV3.18
L2_18: R83.1 SV3.19
L2_19: R84.2 SV3.20
L2_20: R85.1 SV3.21
L2_21: R86.2 SV3.22
L2_22: R87.1 SV3.23
L2_23: R88.2 SV3.24
L2_24: R89.1 SV3.25
L2_25: R90.2 SV3.26
L2_26: R91.1 SV3.27
L2_27: R92.2 SV3.28
L2_28: R93.1 SV3.29
L2_29: R94.2 SV3.30
L2_30: R95.1 SV3.31
L2_31: R96.2 SV3.32
L3_0: R97.1 SV4.1
L3_1: R98.2 SV4.2
L3_2: R99.1 SV4.3
L3_3: R100.2 SV4.4
L3_4: R101.1 SV4.5
L3_5: R102.2 SV4.6
L3_6: R103.1 SV4.7
L3_7: R104.2 SV4.8
L3_8: R105.1 SV4.9
L3_9: R106.2 SV4.10
L3_10: R107.1 SV4.11
L3_11: R108.2 SV4.12
L3_12: R109.1 SV4.13
L3_13: R110.2 SV4.14
L3_14: R111.1 SV4.15
L3_15: R112.2 SV4.16
L3_16: R113.1 SV4.17
L3_17: R114.2 SV4.18
L3_18: R115.1 SV4.19
L3_19: R116.2 SV4.20
L3_20: R117.1 SV4.21
L3_21: R118.2 SV4.22
L3_22: R119.1 SV4.23
L3_23: R120.2 SV4.24
L3_24: R121.1 SV4.25
L3_25: R122.2 SV4.26
L3_26: R123.1 SV4.27
L3_27: R124.2 SV4.28
L3_28: R125.1 SV4.29
L3_29: R126.2 SV4.30
L3_30: R127.1 SV4.31
L3_31: R128.2 SV4.32
N$1: IC17.10(O7) R1.2
N$17: IC17.11(O6) R2.1
N$18: IC17.12(O5) R3.2
N$19: IC17.13(O4) R4.1
N$20: IC17.14(O3) R5.2
N$21: IC17.15(O2) R6.1
N$22: IC17.16(O1) R7.2
N$23: IC32.10(O7) R97.2
N$24: IC32.11(O6) R98.1
N$25: IC32.12(O5) R99.2
N$26: IC32.13(O4) R100.1
N$27: IC32.14(O3) R101.2
N$28: IC32.15(O2) R102.1
N$29: IC32.16(O1) R103.2
N$30: IC33.10(O7) R104.1
N$31: IC33.11(O6) R105.2
N$32: IC33.12(O5) R106.1
N$33: IC33.13(O4) R107.2
N$34: IC33.14(O3) R108.1
N$35: IC33.15(O2) R109.2
N$36: IC33.16(O1) R110.1
N$37: IC34.10(O7) R111.2
N$38: IC34.11(O6) R112.1
N$39: IC34.12(O5) R113.2
N$40: IC34.13(O4) R114.1
N$41: IC34.14(O3) R115.2
N$42: IC34.15(O2) R116.1
N$43: IC34.16(O1) R117.2
N$44: IC35.10(O7) R118.1
N$45: IC35.11(O6) R119.2
N$46: IC35.12(O5) R120.1
N$47: IC35.13(O4) R121.2
N$48: IC35.14(O3) R122.1
N$49: IC35.15(O2) R123.2
N$50: IC35.16(O1) R124.1
N$51: IC36.10(O7) R125.2
N$52: IC36.11(O6) R126.1
N$53: IC36.12(O5) R127.2
N$54: IC36.13(O4) R128.1
N$55: IC18.10(O7) R8.1
N$56: IC18.11(O6) R9.2
N$57: IC18.12(O5) R10.1
N$58: IC18.13(O4) R11.2
N$59: IC18.14(O3) R12.1
N$60: IC18.15(O2) R13.2
N$61: IC18.16(O1) R14.1
N$62: IC19.10(O7) R15.2
N$63: IC19.11(O6) R16.1
N$64: IC19.12(O5) R17.2
N$65: IC19.13(O4) R18.1
N$66: IC19.14(O3) R19.2
N$67: IC19.15(O2) R20.1
N$68: IC19.16(O1) R21.2
N$69: IC20.10(O7) R22.1
N$70: IC20.11(O6) R23.2
N$71: IC20.12(O5) R24.1
N$72: IC20.13(O4) R25.2
N$73: IC20.14(O3) R26.1
N$74: IC20.15(O2) R27.2
N$75: IC20.16(O1) R28.1
N$76: IC21.10(O7) R29.2
N$77: IC21.11(O6) R30.1
N$78: IC21.12(O5) R31.2
N$79: IC21.13(O4) R32.1
N$80: IC22.10(O7) R33.2
N$81: IC22.11(O6) R34.1
N$82: IC22.12(O5) R35.2
N$83: IC22.13(O4) R36.1
N$84: IC22.14(O3) R37.2
N$85: IC22.15(O2) R38.1
N$86: IC22.16(O1) R39.2
N$87: IC23.10(O7) R40.1
N$88: IC23.11(O6) R41.2
N$89: IC23.12(O5) R42.1
N$90: IC23.13(O4) R43.2
N$91: IC23.14(O3) R44.1
N$92: IC23.15(O2) R45.2
N$93: IC23.16(O1) R46.1
N$94: IC24.10(O7) R47.2
N$95: IC24.11(O6) R48.1
N$96: IC24.12(O5) R49.2
N$97: IC24.13(O4) R50.1
N$98: IC24.14(O3) R51.2
N$99: IC24.15(O2) R52.1
N$100: IC24.16(O1) R53.2
N$101: IC25.10(O7) R54.1
N$102: IC25.11(O6) R55.2
N$103: IC25.12(O5) R56.1
N$104: IC25.13(O4) R57.2
N$105: IC25.14(O3) R58.1
N$106: IC25.15(O2) R59.2
N$107: IC25.16(O1) R60.1
N$108: IC26.10(O7) R61.2
N$109: IC26.11(O6) R62.1
N$110: IC26.12(O5) R63.2
N$111: IC26.13(O4) R64.1
N$112: IC27.10(O7) R65.2
N$113: IC27.11(O6) R66.1
N$114: IC27.12(O5) R67.2
N$115: IC27.13(O4) R68.1
N$116: IC27.14(O3) R69.2
N$117: IC27.15(O2) R70.1
N$118: IC27.16(O1) R71.2
N$119: IC28.10(O7) R72.1
N$120: IC28.11(O6) R73.2
N$121: IC28.12(O5) R74.1
N$122: IC28.13(O4) R75.2
N$123: IC28.14(O3) R76.1
N$124: IC28.15(O2) R77.2
N$125: IC28.16(O1) R78.1
N$126: IC29.10(O7) R79.2
N$127: IC29.11(O6) R80.1
N$128: IC29.12(O5) R81.2
N$129: IC29.13(O4) R82.1
N$130: IC29.14(O3) R83.2
N$131: IC29.15(O2) R84.1
N$132: IC29.16(O1) R85.2
N$133: IC30.10(O7) R86.1
N$134: IC30.11(O6) R87.2
N$135: IC30.12(O5) R88.1
N$136: IC30.13(O4) R89.2
N$137: IC30.14(O3) R90.1
N$138: IC30.15(O2) R91.2
N$139: IC30.16(O1) R92.1
N$140: IC31.10(O7) R93.2
N$141: IC31.11(O6) R94.1
N$142: IC31.12(O5) R95.2
N$143: IC31.13(O4) R96.1
Unconnected: IC17.9(CD+) IC18.9(CD+) IC19.9(CD+) IC20.9(CD+) IC21.9(CD+) IC21.14(O3) IC21.15(O2) IC21.16(O1) IC22.9(CD+) IC23.9(CD+) IC24.9(CD+) IC25.9(CD+) IC26.9(CD+) IC26.14(O3) IC26.15(O2) IC26.16(O1) IC27.9(CD+) IC28.9(CD+) IC29.9(CD+) IC30.9(CD+) IC31.9(CD+) IC31.14(O3) IC31.15(O2) IC31.16(O1) IC32.9(CD+) IC33.9(CD+) IC34.9(CD+) IC35.9(CD+) IC36.9(CD+) IC36.14(O3) IC36.15(O2) IC36.16(O1) SV1.33 SV1.34 SV2.33 SV2.34 SV3.33 SV3.34 SV4.33 SV4.34

### Buses
BL3_[0..31]
BL0_[0..31]
BL1_[0..31]
BL2_[0..31]
L0_[0..31]
L1_[0..31]
L2_[0..31]
L3_[0..31]

## Power pins joined to a net without a drawn wire
GND: IC37.8(GND)
VCC: IC37.16(VCC)

## Library data of the parts
C1-C6 C23 = rcl:CPOL-EU: POLARIZED CAPACITOR, European symbol
C7-C22 = rcl:C-EU: CAPACITOR, European symbol
IC1-IC16 = 74xx-eu:74*595: 8-bit SHIFT REGISTER, output latch
IC17-IC36 = uln-udn:ULN2003A: DRIVER ARRAY
IC37 = 74xx-eu:74*138: 3-line to 8-line DECODER/DEMULTIPLEXER
Q1-Q8 = transistor-power:P-MOSFET-SO8: P-Channel MOSFET Example: FDS4435A; P-Channel Logic Level PowerTrench® MOSFET FDS4465; P-Channel 1.8V Specified PowerTrench® MOSFET Source: www.fairchildsemi.com
R1-R132 = rcl:R-EU_: RESISTOR, European symbol
SV1-SV4 = con-harting-ml:ML34: HARTING
SV5 = con-harting-ml:ML34?E: HARTING
SV6 = con-harting-ml:ML14: HARTING; OC_FARNELL: unknown; OC_NEWARK: unknown
X1-X4 = con-rib:ST6,3: RIBBON CABLE CONNECTOR Flachstecker / Faston